# EAGLE schematic Enclosure 85x58 PCB Outline (EAGLE 9.6.2)
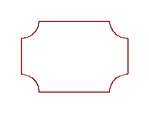
[diagram p0: schematic, sheet 1]

## Parts
U$1  PCB-OUTLINE-85X58-RAW  [PCB-85X58-OUTLINE]

## Library data of the parts
U$1 = digitalconcepts:PCB-OUTLINE-85X58-RAW: PCB outline for 85 x 58 enclosure